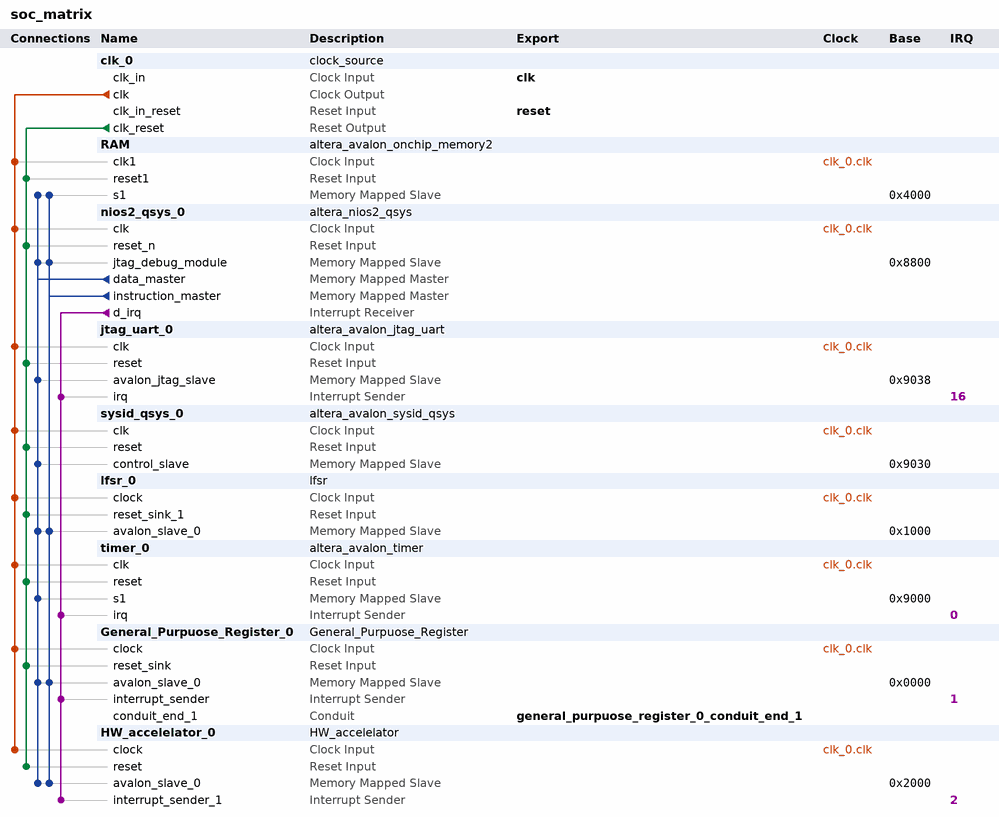
[diagram p0: system contents]
# Platform Designer (Qsys) system soc_matrix, Cyclone II EP2C20F484C7
# Parameters at their usual value, and those the tool derives, are not listed.
package require -exact qsys 13.0
create_system soc_matrix
set_project_property DEVICE_FAMILY {Cyclone II}
set_project_property DEVICE EP2C20F484C7

add_instance clk_0 clock_source 13.0
set_instance_parameter_value clk_0 clockFrequency 50000000

add_instance RAM altera_avalon_onchip_memory2 13.0.1.99.2
set_instance_parameter_value RAM dataWidth 32
set_instance_parameter_value RAM dualPort false
set_instance_parameter_value RAM initMemContent true
set_instance_parameter_value RAM initializationFileName onchip_mem.hex
set_instance_parameter_value RAM memorySize 16384

add_instance nios2_qsys_0 altera_nios2_qsys 13.0
set_instance_parameter_value nios2_qsys_0 resetSlave RAM.s1
set_instance_parameter_value nios2_qsys_0 mmu_TLBMissExcSlave None
set_instance_parameter_value nios2_qsys_0 exceptionSlave RAM.s1
set_instance_parameter_value nios2_qsys_0 breakSlave nios2_qsys_0.jtag_debug_module
set_instance_parameter_value nios2_qsys_0 muldiv_multiplierType NoneSmall
set_instance_parameter_value nios2_qsys_0 impl Tiny
set_instance_parameter_value nios2_qsys_0 icache_size 4096

add_instance jtag_uart_0 altera_avalon_jtag_uart 13.0.1.99.2
set_instance_parameter_value jtag_uart_0 simInteractiveOptions NO_INTERACTIVE_WINDOWS

add_instance sysid_qsys_0 altera_avalon_sysid_qsys 13.0
set_instance_parameter_value sysid_qsys_0 id 0

add_instance lfsr_0 lfsr 1.0

add_instance timer_0 altera_avalon_timer 13.0.1.99.2
set_instance_parameter_value timer_0 period 1
set_instance_parameter_value timer_0 periodUnits MSEC

add_instance General_Purpuose_Register_0 General_Purpuose_Register 2.0

add_instance HW_accelelator_0 HW_accelelator 1.0
set_instance_parameter_value HW_accelelator_0 Width 32

# connections
add_connection clk_0.clk General_Purpuose_Register_0.clock clock
add_connection clk_0.clk HW_accelelator_0.clock clock
add_connection clk_0.clk jtag_uart_0.clk clock
add_connection clk_0.clk lfsr_0.clock clock
add_connection clk_0.clk nios2_qsys_0.clk clock
add_connection clk_0.clk RAM.clk1 clock
add_connection clk_0.clk sysid_qsys_0.clk clock
add_connection clk_0.clk timer_0.clk clock
add_connection clk_0.clk_reset General_Purpuose_Register_0.reset_sink reset
add_connection clk_0.clk_reset HW_accelelator_0.reset reset
add_connection clk_0.clk_reset jtag_uart_0.reset reset
add_connection clk_0.clk_reset lfsr_0.reset_sink_1 reset
add_connection clk_0.clk_reset nios2_qsys_0.reset_n reset
add_connection clk_0.clk_reset RAM.reset1 reset
add_connection clk_0.clk_reset sysid_qsys_0.reset reset
add_connection clk_0.clk_reset timer_0.reset reset
add_connection nios2_qsys_0.data_master General_Purpuose_Register_0.avalon_slave_0 avalon
set_connection_parameter_value nios2_qsys_0.data_master/General_Purpuose_Register_0.avalon_slave_0 baseAddress 0x0000
add_connection nios2_qsys_0.data_master HW_accelelator_0.avalon_slave_0 avalon
set_connection_parameter_value nios2_qsys_0.data_master/HW_accelelator_0.avalon_slave_0 baseAddress 0x2000
add_connection nios2_qsys_0.data_master jtag_uart_0.avalon_jtag_slave avalon
set_connection_parameter_value nios2_qsys_0.data_master/jtag_uart_0.avalon_jtag_slave baseAddress 0x9038
add_connection nios2_qsys_0.data_master lfsr_0.avalon_slave_0 avalon
set_connection_parameter_value nios2_qsys_0.data_master/lfsr_0.avalon_slave_0 baseAddress 0x1000
add_connection nios2_qsys_0.data_master nios2_qsys_0.jtag_debug_module avalon
set_connection_parameter_value nios2_qsys_0.data_master/nios2_qsys_0.jtag_debug_module baseAddress 0x8800
add_connection nios2_qsys_0.data_master RAM.s1 avalon
set_connection_parameter_value nios2_qsys_0.data_master/RAM.s1 baseAddress 0x4000
add_connection nios2_qsys_0.data_master sysid_qsys_0.control_slave avalon
set_connection_parameter_value nios2_qsys_0.data_master/sysid_qsys_0.control_slave baseAddress 0x9030
add_connection nios2_qsys_0.data_master timer_0.s1 avalon
set_connection_parameter_value nios2_qsys_0.data_master/timer_0.s1 baseAddress 0x9000
add_connection nios2_qsys_0.instruction_master General_Purpuose_Register_0.avalon_slave_0 avalon
set_connection_parameter_value nios2_qsys_0.instruction_master/General_Purpuose_Register_0.avalon_slave_0 baseAddress 0x0000
add_connection nios2_qsys_0.instruction_master HW_accelelator_0.avalon_slave_0 avalon
set_connection_parameter_value nios2_qsys_0.instruction_master/HW_accelelator_0.avalon_slave_0 baseAddress 0x2000
add_connection nios2_qsys_0.instruction_master lfsr_0.avalon_slave_0 avalon
set_connection_parameter_value nios2_qsys_0.instruction_master/lfsr_0.avalon_slave_0 baseAddress 0x1000
add_connection nios2_qsys_0.instruction_master nios2_qsys_0.jtag_debug_module avalon
set_connection_parameter_value nios2_qsys_0.instruction_master/nios2_qsys_0.jtag_debug_module baseAddress 0x8800
add_connection nios2_qsys_0.instruction_master RAM.s1 avalon
set_connection_parameter_value nios2_qsys_0.instruction_master/RAM.s1 baseAddress 0x4000
add_connection nios2_qsys_0.d_irq General_Purpuose_Register_0.interrupt_sender interrupt
set_connection_parameter_value nios2_qsys_0.d_irq/General_Purpuose_Register_0.interrupt_sender irqNumber 1
add_connection nios2_qsys_0.d_irq HW_accelelator_0.interrupt_sender_1 interrupt
set_connection_parameter_value nios2_qsys_0.d_irq/HW_accelelator_0.interrupt_sender_1 irqNumber 2
add_connection nios2_qsys_0.d_irq jtag_uart_0.irq interrupt
set_connection_parameter_value nios2_qsys_0.d_irq/jtag_uart_0.irq irqNumber 16
add_connection nios2_qsys_0.d_irq timer_0.irq interrupt
set_connection_parameter_value nios2_qsys_0.d_irq/timer_0.irq irqNumber 0

# exported interfaces
add_interface clk clock sink
set_interface_property clk EXPORT_OF clk_0.clk_in
add_interface reset reset sink
set_interface_property reset EXPORT_OF clk_0.clk_in_reset
add_interface general_purpuose_register_0_conduit_end_1 conduit end
set_interface_property general_purpuose_register_0_conduit_end_1 EXPORT_OF General_Purpuose_Register_0.conduit_end_1

set_interconnect_requirement {$system} qsys_mm.clockCrossingAdapter HANDSHAKE
set_interconnect_requirement {$system} qsys_mm.maxAdditionalLatency 1

save_system soc_matrix.qsys
